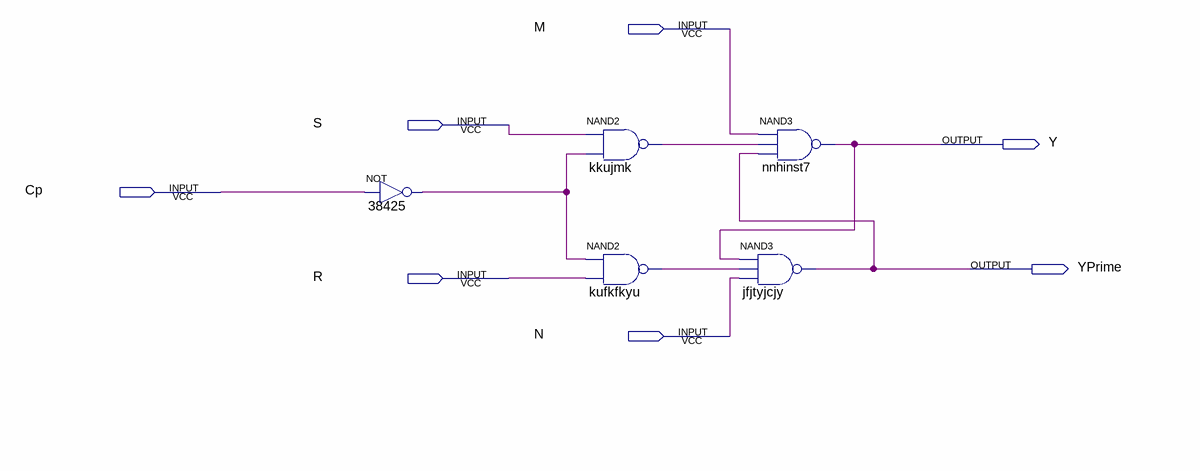
[diagram p0: schematic sheet]
// Quartus schematic SRflipFlop.bdf as structural Verilog: 5 symbols, 7 pins
module SRflipFlop (
  input  M,
  input  S,
  input  Cp,
  input  R,
  input  N,
  output Y,
  output YPrime
);

  wire kkujmk_out, kufkfkyu_out, n38425_out;

  not u_38425 (n38425_out, Cp);
  nand kkujmk (kkujmk_out, S, n38425_out);
  nand kufkfkyu (kufkfkyu_out, n38425_out, R);
  nand nnhinst7 (Y, M, kkujmk_out, YPrime);
  nand jfjtyjcjy (YPrime, Y, kufkfkyu_out, N);
endmodule
